# Altium schematic sheet TataconUSB.SchDoc
size A4
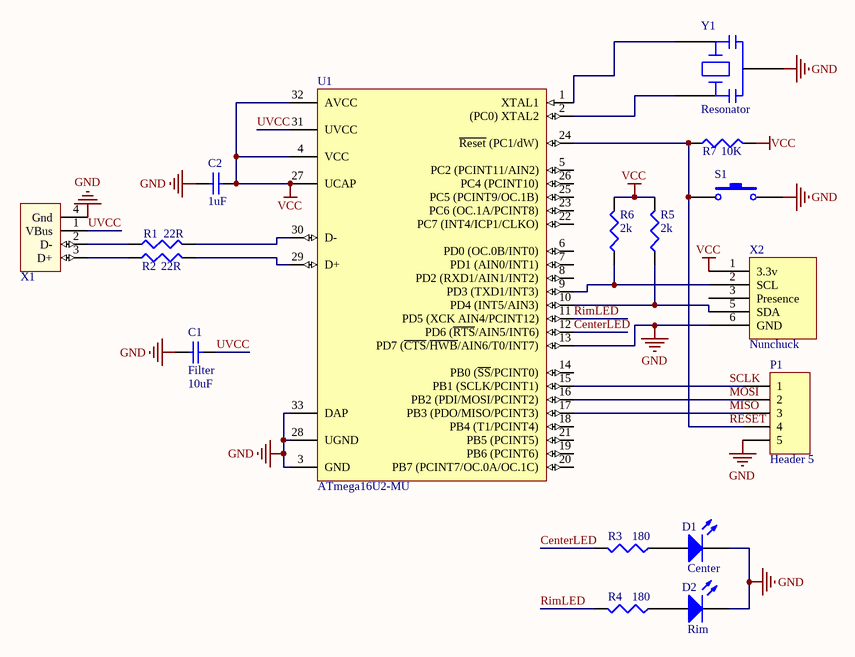
[diagram p0: TataconUSB.SchDoc]

## Parts
C1  Filter  value 10uF  [0805]
C2  value 1uF  [1608[0603]]  (hidden comment: Cap Semi)
D1  Center  [LED_0603]
D2  Rim  [LED_0603]
P1  Header 5  [HDR1X5]
R1  value 22R  [J1-0603]  (hidden comment: Res3)
R2  value 22R  [J1-0603]  (hidden comment: Res3)
R3  value 180  [J1-0603]  (hidden comment: Res3)
R4  value 180  [J1-0603]  (hidden comment: Res3)
R5  value 2k  [J1-0603]  (hidden comment: Res3)
R6  value 2k  [J1-0603]  (hidden comment: Res3)
R7  value 10K  [J1-0603]
S1  SW-PB  [SKQGADE010]  (value not drawn)
U1  ATmega16U2-MU  [32PG_N]
X1  USB Connector  [USB_A_MALE]  (value not drawn)
X2  Nunchuck  [NUNCHUCK]
Y1  Resonator  [RESONATOR]

## Nets
GND: C1.2 C2.2 D1.2(K) D2.2(K) P1.5 S1.2 U1.3(GND) U1.13(PD7_(~{CTS}/~{HWB}/AIN6/T0/INT7)) U1.28(UGND) U1.33(DAP) X1.4(Gnd) X2.6(GND) Y1.2
VCC: C2.1 R5.2 R6.2 R7.2 U1.4(VCC) U1.27(UCAP) U1.32(AVCC) X2.1(3.3v)
CenterLED: R3.2 U1.12(PD6_(~{RTS}/AIN5/INT6))
MISO: P1.3 U1.17(PB3_(PDO/MISO/PCINT3))
MOSI: P1.2 U1.16(PB2_(PDI/MOSI/PCINT2))
RESET: P1.4 R7.1 S1.1 U1.24(~{Reset}_(PC1/dW))
RimLED: R4.2 U1.11(PD5_(XCK_AIN4/PCINT12))
SCLK: P1.1 U1.15(PB1_(SCLK/PCINT1))
UVCC: C1.1 U1.31(UVCC) X1.1(VBus)
NetD1_1: D1.1(A) R3.1
NetD2_1: D2.1(A) R4.1
NetR1_1: R1.1 X1.2(D-)
NetR1_2: R1.2 U1.30(D-)
NetR2_1: R2.1 X1.3(D+)
NetR2_2: R2.2 U1.29(D+)
NetR5_1: R5.1 U1.10(PD4_(INT5/AIN3)) X2.5(SDA)
NetR6_1: R6.1 U1.9(PD3_(TXD1/INT3)) X2.2(SCL)
NetU1_1: U1.1(XTAL1) Y1.3
NetU1_2: U1.2((PC0)_XTAL2) Y1.1

Not connected (* = marked no-connect by the designer): U1 5(PC2_(PCINT11/AIN2)) 6(PD0_(OC.0B/INT0)) 7(PD1_(AIN0/INT1)) 8(PD2_(RXD1/AIN1/INT2)) 14(PB0_(~{SS}/PCINT0)) 18(PB4_(T1/PCINT4)) 19(PB6_(PCINT6)) 20(PB7_(PCINT7/OC.0A/OC.1C)) 21(PB5_(PCINT5)) 22(PC7_(INT4/ICP1/CLKO)) 23(PC6_(OC.1A/PCINT8)) 25(PC5_(PCINT9/OC.1B)) 26(PC4_(PCINT10)); X2 3(Presence)

## Notes on the sheet
- (near U1) We can leave HWB attached to ground as it is only sampled at reset, not power on

## Library data of the parts
C1 = Cap Semi: Capacitor (Semiconductor SIM Model); Seeed Part: 302010178; Published: 8-Jun-2000; LatestRevisionDate: 29-May-2009; LatestRevisionNote: IPC-7351 Footprint Added.; PackageReference: C1206; Publisher: Altium Limited; PackageDescription: Chip Capacitor
C2 = Cap Semi: Capacitor (Semiconductor SIM Model); Seeed part: 302010139; Published: 8-Jun-2000; LatestRevisionDate: 29-May-2009; LatestRevisionNote: IPC-7351 Footprint Added.; PackageReference: C1206; Publisher: Altium Limited; PackageDescription: Chip Capacitor
D1 = LED2: Typical RED, GREEN, YELLOW, AMBER GaAs LED; Seeed part: 304090042; Published: 8-Jun-2000; LatestRevisionDate: 17-Jul-2002; LatestRevisionNote: Re-released for DXP Platform.; PackageVersion: Feb-2002; PackageReference: 3.2X1.6X1.1; Publisher: Altium Limited; PackageDescription: SM LED; 2 Flat Leads
D2 = LED2: Typical RED, GREEN, YELLOW, AMBER GaAs LED; Seeed part: 304090045; Published: 8-Jun-2000; LatestRevisionDate: 17-Jul-2002; LatestRevisionNote: Re-released for DXP Platform.; PackageVersion: Feb-2002; PackageReference: 3.2X1.6X1.1; Publisher: Altium Limited; PackageDescription: SM LED; 2 Flat Leads
P1 = Header 5: Header, 5-Pin; LatestRevisionDate: 17-Jul-2002; LatestRevisionNote: Re-released for DXP Platform.; Publisher: Altium Limited
R1 R2 R5 R6 = Res3: Resistor; Seeed part: 301010289; Published: 8-Jun-2000; LatestRevisionDate: 29-May-2009; LatestRevisionNote: IPC-7351 Footprint Added.; PackageReference: J1-0603; Publisher: Altium Limited; PackageDescription: Chip Resistor
R3 R4 = Res3: Resistor; Seeed part: 301010163; Published: 8-Jun-2000; LatestRevisionDate: 29-May-2009; LatestRevisionNote: IPC-7351 Footprint Added.; PackageReference: J1-0603; Publisher: Altium Limited; PackageDescription: Chip Resistor
R7 = Res3: Resistor; Seeed part: 301010299; Published: 8-Jun-2000; LatestRevisionDate: 29-May-2009; LatestRevisionNote: IPC-7351 Footprint Added.; PackageReference: J1-0603; Publisher: Altium Limited; PackageDescription: Chip Resistor
S1 = SW-PB: Switch; Seeed Part: 311020017; Published: 24-Mar-1999; LatestRevisionDate: 17-Jul-2002; LatestRevisionNote: Re-released for DXP Platform.; PackageReference: SPST-2; Publisher: Altium Limited; PackageDescription: Switch; 2 Leads; Manufacturer Part: SKQGADE010
U1 = ATmega16U2-MU: 8-bit AVR Microcontroller, 2.7-5.5V, 16KB Flash, 512 Bytes EEPROM, 512 Bytes SRAM, 32-pin VQFN, Industrial Grade (-40°C to 85°C); Seeed part: 310010018; Published: 1-Apr-2010; DatasheetVersion: revC, Dec-2009; PackageVersion: revA, Oct-2008; PackageReference: 32PG; Publisher: Altium Limited; PackageDescription: 32-Pin Quad Flat No-Lead (QFN) Sawn,  5 x 5 x 1.0 mm Body, Pitch 0.50 mm, 3.60mm Exposed Pad; Supplier 1: Digi-Key; Supplier Part Number 1: ATMEGA16U2-MU-ND; Supplier 2: Mouser; Supplier Part Number 2: 556-ATMEGA16U2-MU; Code_JEDEC: MO-220WHHD-2; ComponentLink1Description: Manufacturer Link; ComponentLink1URL: http://www.atmel.com/products/avr/default.asp?; ComponentLink2Description: ATmega8U2/16U2/32U2 Datasheet; ComponentLink2URL: http://www.atmel.com/dyn/resources/prod_documents/doc7799.pdf; ComponentLink3Description: ATmega8U2/16U2/32U2 Summary; ComponentLink3URL: http://www.atmel.com/dyn/resources/prod_documents/7799S.pdf; ComponentLink4Description: Atmel.com Home; ComponentLink4URL: http://www.atmel.com
X1 = USB Connector: Date Created: 08/09/2014